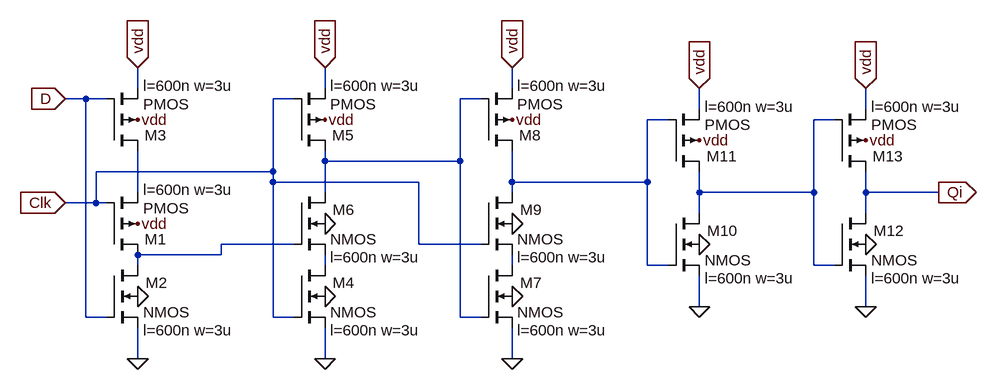
[diagram p0: schematic dflop.asc]
dflop.asc, the LTspice schematic file:
Version 4
SHEET 1 1692 680
WIRE 272 -208 272 -240
WIRE 560 -208 560 -240
WIRE 848 -208 848 -240
WIRE 192 -192 160 -192
WIRE 224 -192 192 -192
WIRE 512 -192 480 -192
WIRE 800 -192 768 -192
WIRE 1136 -176 1136 -208
WIRE 1392 -176 1392 -208
WIRE 1088 -160 1056 -160
WIRE 1344 -160 1312 -160
WIRE 560 -96 560 -112
WIRE 768 -96 768 -192
WIRE 768 -96 560 -96
WIRE 480 -80 480 -192
WIRE 480 -80 208 -80
WIRE 480 -64 480 -80
WIRE 704 -64 480 -64
WIRE 848 -64 848 -112
WIRE 1056 -64 1056 -160
WIRE 1056 -64 848 -64
WIRE 272 -48 272 -112
WIRE 560 -48 560 -96
WIRE 848 -48 848 -64
WIRE 1136 -48 1136 -80
WIRE 1312 -48 1312 -160
WIRE 1312 -48 1136 -48
WIRE 1392 -48 1392 -80
WIRE 1504 -48 1392 -48
WIRE 208 -32 208 -80
WIRE 208 -32 160 -32
WIRE 224 -32 208 -32
WIRE 1136 -16 1136 -48
WIRE 1392 -16 1392 -48
WIRE 512 32 400 32
WIRE 704 32 704 -64
WIRE 800 32 704 32
WIRE 400 48 400 32
WIRE 400 48 272 48
WIRE 272 64 272 48
WIRE 560 64 560 48
WIRE 848 64 848 48
WIRE 1056 64 1056 -64
WIRE 1088 64 1056 64
WIRE 1312 64 1312 -48
WIRE 1344 64 1312 64
WIRE 1136 128 1136 80
WIRE 1392 128 1392 80
WIRE 192 144 192 -192
WIRE 224 144 192 144
WIRE 480 144 480 -64
WIRE 512 144 480 144
WIRE 768 144 768 -96
WIRE 800 144 768 144
WIRE 272 208 272 160
WIRE 560 208 560 160
WIRE 848 208 848 160
FLAG 272 208 0
FLAG 272 112 0
FLAG 160 -192 D
IOPIN 160 -192 In
FLAG 272 -240 vdd
IOPIN 272 -240 In
FLAG 272 -160 vdd
FLAG 1504 -48 Qi
IOPIN 1504 -48 Out
FLAG 160 -32 Clk
IOPIN 160 -32 In
FLAG 272 0 vdd
FLAG 560 208 0
FLAG 560 112 0
FLAG 560 -240 vdd
IOPIN 560 -240 In
FLAG 560 -160 vdd
FLAG 560 0 0
FLAG 848 208 0
FLAG 848 112 0
FLAG 848 -240 vdd
IOPIN 848 -240 In
FLAG 848 -160 vdd
FLAG 848 0 0
FLAG 1136 128 0
FLAG 1136 32 0
FLAG 1136 -208 vdd
IOPIN 1136 -208 In
FLAG 1136 -128 vdd
FLAG 1392 128 0
FLAG 1392 32 0
FLAG 1392 -208 vdd
IOPIN 1392 -208 In
FLAG 1392 -128 vdd
SYMBOL nmos4 224 64 R0
WINDOW 123 56 100 Left 2
WINDOW 0 60 27 Left 2
SYMATTR Value2 l=600n w=3u
SYMATTR InstName M2
SYMBOL pmos4 224 -112 M180
WINDOW 123 56 100 Left 2
WINDOW 0 59 24 Left 2
SYMATTR Value2 l=600n w=3u
SYMATTR InstName M3
SYMBOL pmos4 224 48 M180
WINDOW 123 56 100 Left 2
WINDOW 0 59 24 Left 2
SYMATTR Value2 l=600n w=3u
SYMATTR InstName M1
SYMBOL nmos4 512 64 R0
WINDOW 123 56 100 Left 2
WINDOW 0 60 27 Left 2
SYMATTR Value2 l=600n w=3u
SYMATTR InstName M4
SYMBOL pmos4 512 -112 M180
WINDOW 123 56 100 Left 2
WINDOW 0 59 24 Left 2
SYMATTR Value2 l=600n w=3u
SYMATTR InstName M5
SYMBOL nmos4 512 -48 R0
WINDOW 123 56 100 Left 2
WINDOW 0 60 27 Left 2
SYMATTR Value2 l=600n w=3u
SYMATTR InstName M6
SYMBOL nmos4 800 64 R0
WINDOW 123 56 100 Left 2
WINDOW 0 60 27 Left 2
SYMATTR Value2 l=600n w=3u
SYMATTR InstName M7
SYMBOL pmos4 800 -112 M180
WINDOW 123 56 100 Left 2
WINDOW 0 59 24 Left 2
SYMATTR Value2 l=600n w=3u
SYMATTR InstName M8
SYMBOL nmos4 800 -48 R0
WINDOW 123 56 100 Left 2
WINDOW 0 60 27 Left 2
SYMATTR Value2 l=600n w=3u
SYMATTR InstName M9
SYMBOL nmos4 1088 -16 R0
WINDOW 123 56 100 Left 2
WINDOW 0 60 27 Left 2
SYMATTR Value2 l=600n w=3u
SYMATTR InstName M10
SYMBOL pmos4 1088 -80 M180
WINDOW 123 56 100 Left 2
WINDOW 0 59 24 Left 2
SYMATTR Value2 l=600n w=3u
SYMATTR InstName M11
SYMBOL nmos4 1344 -16 R0
WINDOW 123 56 100 Left 2
WINDOW 0 60 27 Left 2
SYMATTR Value2 l=600n w=3u
SYMATTR InstName M12
SYMBOL pmos4 1344 -80 M180
WINDOW 123 56 100 Left 2
WINDOW 0 59 24 Left 2
SYMATTR Value2 l=600n w=3u
SYMATTR InstName M13

The netlist it stands for:
* dflop.asc
M2 N005 D 0 0 NMOS l=600n w=3u
M3 N004 D vdd vdd PMOS l=600n w=3u
M1 N005 Clk N004 vdd PMOS l=600n w=3u
M4 N006 Clk 0 0 NMOS l=600n w=3u
M5 N001 Clk vdd vdd PMOS l=600n w=3u
M6 N001 N005 N006 0 NMOS l=600n w=3u
M7 N007 N001 0 0 NMOS l=600n w=3u
M8 N002 N001 vdd vdd PMOS l=600n w=3u
M9 N002 Clk N007 0 NMOS l=600n w=3u
M10 N003 N002 0 0 NMOS l=600n w=3u
M11 N003 N002 vdd vdd PMOS l=600n w=3u
M12 Qi N003 0 0 NMOS l=600n w=3u
M13 Qi N003 vdd vdd PMOS l=600n w=3u
.model NMOS NMOS
.model PMOS PMOS
.lib standard.mos
.backanno
.end